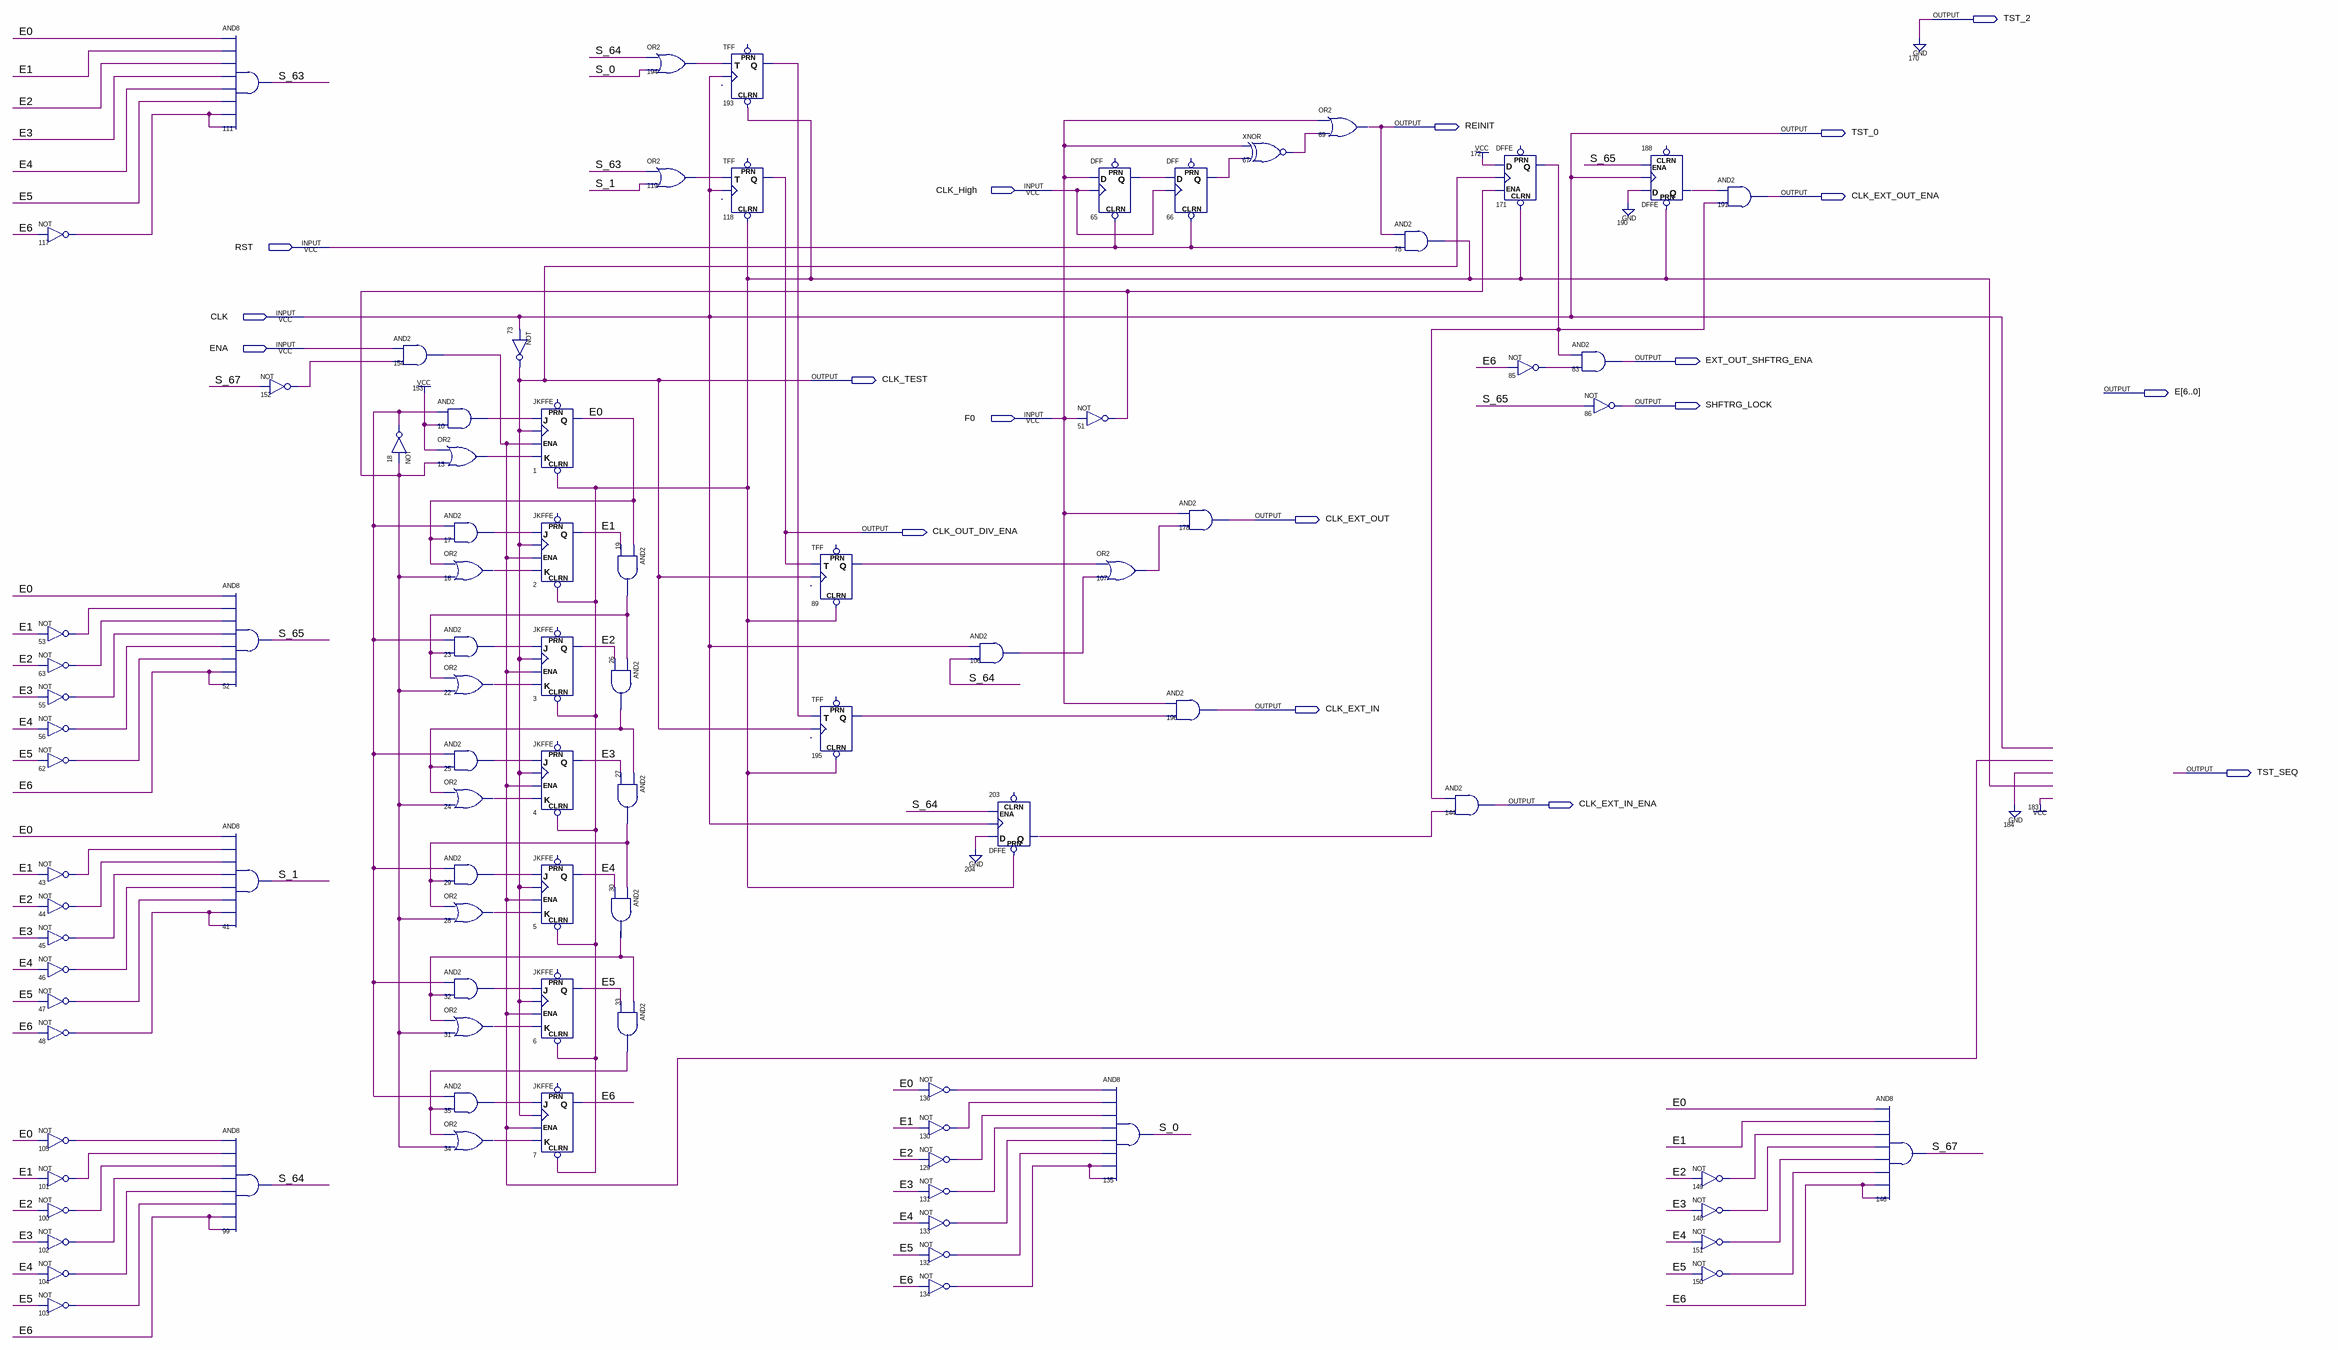
[diagram p0: schematic sheet]
// Quartus schematic shrg_ctrl8.bdf as structural Verilog: 89 symbols, 18 pins
module shrg_ctrl8 (
  input  CLK_High,
  input  RST,
  input  CLK,
  input  ENA,
  input  F0,
  output TST_2,
  output REINIT,
  output TST_0,
  output CLK_EXT_OUT_ENA,
  output EXT_OUT_SHFTRG_ENA,
  output CLK_TEST,
  output [6:0] E,
  output SHFTRG_LOCK,
  output CLK_EXT_OUT,
  output CLK_OUT_DIV_ENA,
  output CLK_EXT_IN,
  output TST_SEQ,
  output CLK_EXT_IN_ENA
);

  wire n10_out, n13_out, n16_out, n17_out, n18_out, n19_out, n22_out, n23_out, n24_out, n25_out, n26_out,
       n27_out, n28_out, n29_out, n30_out, n31_out, n32_out, n33_out, n34_out, n35_out, n43_out, n44_out,
       n45_out, n46_out, n47_out, n48_out, n51_out, n53_out, n55_out, n56_out, n62_out, n63_out, n65_q,
       n66_q, n67_out, n78_out, n85_out, n89_q, n100_out, n101_out, n102_out, n103_out, n104_out, n105_out,
       n106_out, n107_out, n117_out, n119_out, n129_out, n130_out, n131_out, n132_out, n133_out, n134_out,
       n136_out, n148_out, n149_out, n150_out, n151_out, n152_out, n154_out, n171_q, n188_q, n193_q,
       n194_out, n195_q, n203_q, S_0, S_1, S_63, S_64, S_65, S_67;

  not u_117 (n117_out, E[6]);
  not u_53 (n53_out, E[1]);
  not u_63 (n63_out, E[2]);
  not u_55 (n55_out, E[3]);
  not u_56 (n56_out, E[4]);
  not u_62 (n62_out, E[5]);
  not u_43 (n43_out, E[1]);
  not u_44 (n44_out, E[2]);
  not u_45 (n45_out, E[3]);
  not u_46 (n46_out, E[4]);
  not u_47 (n47_out, E[5]);
  not u_48 (n48_out, E[6]);
  not u_105 (n105_out, E[0]);
  not u_101 (n101_out, E[1]);
  not u_100 (n100_out, E[2]);
  not u_102 (n102_out, E[3]);
  not u_104 (n104_out, E[4]);
  not u_103 (n103_out, E[5]);
  and u_111 (S_63, E[0], E[1], E[2], E[3], E[4], E[5], n117_out, n117_out);
  and u_52 (S_65, E[0], n53_out, n63_out, n55_out, n56_out, n62_out, E[6], E[6]);
  and u_41 (S_1, E[0], n43_out, n44_out, n45_out, n46_out, n47_out, n48_out, n48_out);
  and u_99 (S_64, n105_out, n101_out, n100_out, n102_out, n104_out, n103_out, E[6], E[6]);
  not u_152 (n152_out, S_67);
  and u_154 (n154_out, ENA, n152_out);
  not u_18 (n18_out, n51_out);
  and u_10 (n10_out, n18_out, 1'b1);
  or u_13 (n13_out, 1'b1, n51_out);
  and u_17 (n17_out, n18_out, E[0]);
  or u_16 (n16_out, E[0], n51_out);
  and u_23 (n23_out, n18_out, n19_out);
  or u_22 (n22_out, n19_out, n51_out);
  and u_25 (n25_out, n18_out, n26_out);
  or u_24 (n24_out, n26_out, n51_out);
  and u_29 (n29_out, n18_out, n27_out);
  or u_28 (n28_out, n27_out, n51_out);
  and u_32 (n32_out, n18_out, n30_out);
  or u_31 (n31_out, n30_out, n51_out);
  and u_35 (n35_out, n18_out, n33_out);
  or u_34 (n34_out, n33_out, n51_out);
  not u_73 (CLK_TEST, CLK);
  JKFFE u_1 (.J(n10_out), .CLK(CLK_TEST), .CLRN(n78_out), .K(n13_out), .ENA(n154_out), .Q(E[0]));  // open: PRN
  JKFFE u_2 (.J(n17_out), .CLK(CLK_TEST), .CLRN(n78_out), .K(n16_out), .ENA(n154_out), .Q(E[1]));  // open: PRN
  JKFFE u_3 (.J(n23_out), .CLK(CLK_TEST), .CLRN(n78_out), .K(n22_out), .ENA(n154_out), .Q(E[2]));  // open: PRN
  JKFFE u_4 (.J(n25_out), .CLK(CLK_TEST), .CLRN(n78_out), .K(n24_out), .ENA(n154_out), .Q(E[3]));  // open: PRN
  JKFFE u_5 (.J(n29_out), .CLK(CLK_TEST), .CLRN(n78_out), .K(n28_out), .ENA(n154_out), .Q(E[4]));  // open: PRN
  JKFFE u_6 (.J(n32_out), .CLK(CLK_TEST), .CLRN(n78_out), .K(n31_out), .ENA(n154_out), .Q(E[5]));  // open: PRN
  JKFFE u_7 (.J(n35_out), .CLK(CLK_TEST), .CLRN(n78_out), .K(n34_out), .ENA(n154_out), .Q(E[6]));  // open: PRN
  and u_19 (n19_out, E[0], E[1]);
  and u_26 (n26_out, n19_out, E[2]);
  and u_27 (n27_out, n26_out, E[3]);
  and u_30 (n30_out, n27_out, E[4]);
  and u_33 (n33_out, n30_out, E[5]);
  or u_194 (n194_out, S_64, S_0);
  or u_119 (n119_out, S_63, S_1);
  TFF u_193 (.CLRN(n78_out), .T(n194_out), .CLK(CLK), .Q(n193_q));  // open: PRN
  TFF u_118 (.CLRN(n78_out), .T(n119_out), .CLK(CLK), .Q(CLK_OUT_DIV_ENA));  // open: PRN
  TFF u_89 (.CLRN(n78_out), .T(CLK_OUT_DIV_ENA), .CLK(CLK_TEST), .Q(n89_q));  // open: PRN
  TFF u_195 (.CLRN(n78_out), .T(n193_q), .CLK(CLK_TEST), .Q(n195_q));  // open: PRN
  not u_136 (n136_out, E[0]);
  not u_130 (n130_out, E[1]);
  not u_129 (n129_out, E[2]);
  not u_131 (n131_out, E[3]);
  not u_133 (n133_out, E[4]);
  not u_132 (n132_out, E[5]);
  not u_134 (n134_out, E[6]);
  and u_106 (n106_out, CLK, S_64);
  DFFE u_203 (.PRN(n78_out), .D(1'b0), .CLK(CLK), .ENA(S_64), .Q(n203_q));  // open: CLRN
  DFF u_65 (.CLRN(RST), .CLK(CLK_High), .D(F0), .Q(n65_q));  // open: PRN
  not u_51 (n51_out, F0);
  or u_107 (n107_out, n89_q, n106_out);
  and u_135 (S_0, n136_out, n130_out, n129_out, n131_out, n133_out, n132_out, n134_out, n134_out);
  DFF u_66 (.CLRN(RST), .CLK(CLK_High), .D(n65_q), .Q(n66_q));  // open: PRN
  and u_178 (CLK_EXT_OUT, F0, n107_out);
  and u_196 (CLK_EXT_IN, F0, n195_q);
  xnor u_67 (n67_out, F0, n66_q);
  or u_69 (REINIT, F0, n67_out);
  and u_78 (n78_out, REINIT, RST);
  and u_144 (CLK_EXT_IN_ENA, n171_q, n203_q);
  DFFE u_171 (.CLRN(n78_out), .D(1'b1), .CLK(CLK_TEST), .ENA(n51_out), .Q(n171_q));  // open: PRN
  not u_85 (n85_out, E[6]);
  and u_83 (EXT_OUT_SHFTRG_ENA, n171_q, n85_out);
  not u_86 (SHFTRG_LOCK, S_65);
  DFFE u_188 (.PRN(n78_out), .D(1'b0), .CLK(CLK), .ENA(S_65), .Q(n188_q));  // open: CLRN
  not u_149 (n149_out, E[2]);
  not u_148 (n148_out, E[3]);
  not u_151 (n151_out, E[4]);
  not u_150 (n150_out, E[5]);
  and u_191 (CLK_EXT_OUT_ENA, n188_q, n171_q);
  and u_146 (S_67, E[0], E[1], n149_out, n148_out, n151_out, n150_out, E[6], E[6]);

  assign TST_0 = CLK;
  assign TST_2 = 1'b0;
endmodule
